# EAGLE design Regulador (EAGLE 9.6.2)
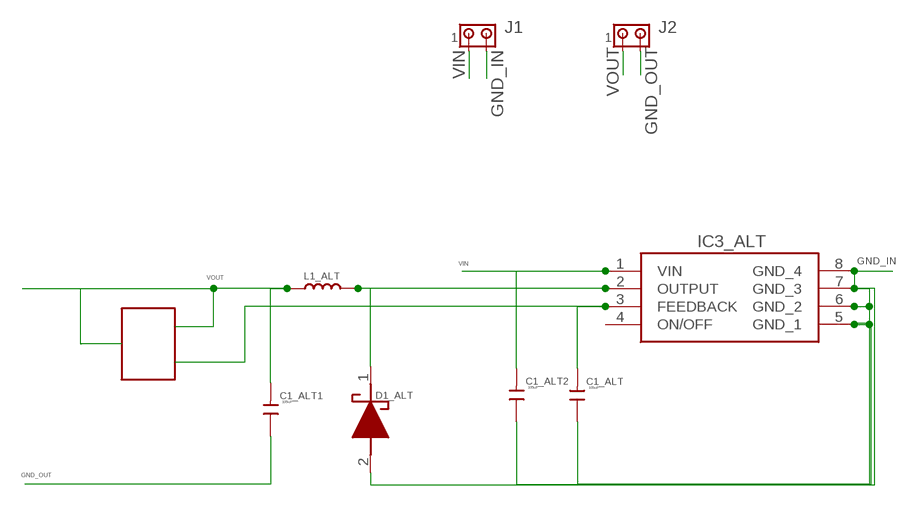
[diagram p0: schematic, sheet 1]

## Parts
C1_ALT  105uF  C-0805  [C0805]
C1_ALT1  105uF  C-0805  [C0805]
C1_ALT2  105uF  C-0805  [C0805]
D1_ALT  1N5819HW1-7-F  [SODFL3518X115N]
IC3_ALT  XL1509-3.3E1  [SOIC127P600X175-8N]
J1  MTA02-156  [1X2MTA]
J2  MTA02-156  [1X2MTA]
L1_ALT  47uH  L'PIO73'  [PIO73]
U$1  TRIMPOT  [TRIMPOT]

## Nets
GND_IN: C1_ALT2.1 C1_ALT.1 D1_ALT.2(A) IC3_ALT.5(GND_1) IC3_ALT.6(GND_2) IC3_ALT.7(GND_3) IC3_ALT.8(GND_4) J1.2
GND_OUT: C1_ALT1.1 J2.2
N$3: D1_ALT.1(K) IC3_ALT.2(OUTPUT) L1_ALT.1
N$8: C1_ALT.2 IC3_ALT.3(FEEDBACK) U$1.OUT
VIN: C1_ALT2.2 IC3_ALT.1(VIN) J1.1
VOUT: C1_ALT1.2 J2.1 L1_ALT.2 U$1.VCC1 U$1.VCC2
Unconnected: IC3_ALT.4(ON/OFF)

## Library data of the parts
C1_ALT C1_ALT1 C1_ALT2 = discrete:C*: Ceramic Capacitors
D1_ALT = 1N5819HW1-7-F:1N5819HW1-7-F: 1N5819 Schottky Diode 40V 1A SOD123F Source: Datasheet <https://www.diodes.com/assets/Datasheets/1N5819HW1.pdf>; ARROW_PART_NUMBER: 1N5819HW1-7-F; ARROW_PRICE-STOCK: https://www.arrow.com/en/products/1n5819hw1-7-f/diodes-incorporated?region=nac; DESCRIPTION: 1N5819 Schottky Diode 40V 1A SOD123F; HEIGHT: 1.15mm; MANUFACTURER_NAME: Diodes Inc.; MANUFACTURER_PART_NUMBER: 1N5819HW1-7-F; MOUSER_PART_NUMBER: 621-1N5819HW1-7-F; MOUSER_PRICE-STOCK: https://www.mouser.co.uk/ProductDetail/Diodes-Incorporated/1N5819HW1-7-F?qs=60RJRzIpcl9ACQG7Zn63jQ%3D%3D
IC3_ALT = XL1509-3.3E1:XL1509-3.3E1: 40V 2A SOP-8_150mil DC-DC Converters RoHS Source: Datasheet <https://datasheet.lcsc.com/szlcsc/XLSEMI-XL1509-3-3E1_C74193.pdf>; DESCRIPTION: 40V 2A SOP-8_150mil DC-DC Converters RoHS; HEIGHT: 1.75mm; MANUFACTURER_NAME: XLSEMI; MANUFACTURER_PART_NUMBER: XL1509-3.3E1
J1 J2 = con-amp:MTA02-156: AMP connector
L1_ALT = discrete:L*
U$1 = TRIMPOT:TRIMPOT

## Board
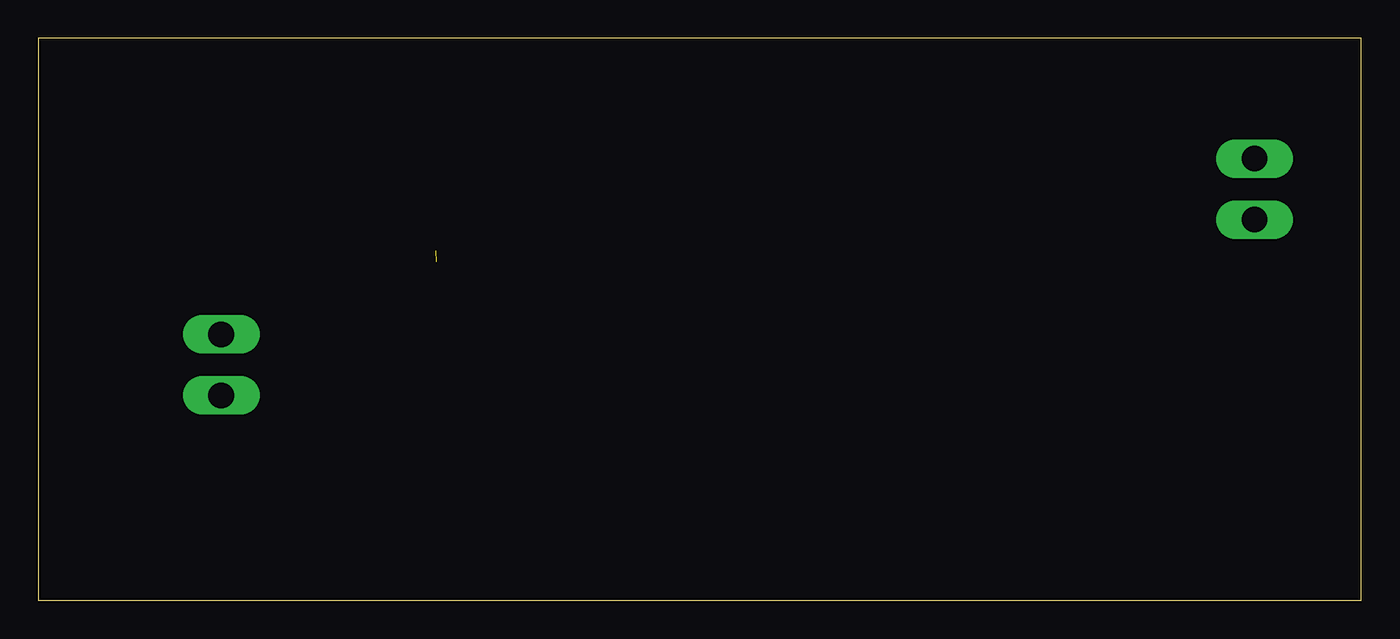
[diagram p1: board, top side]
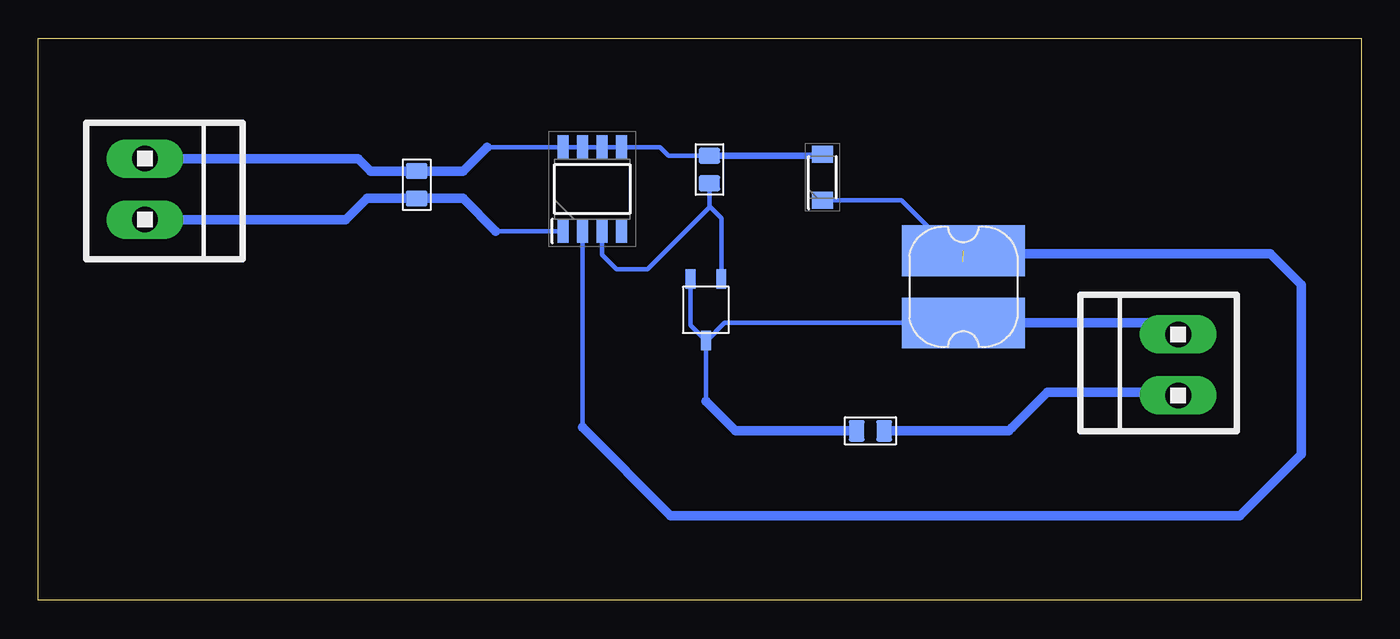
[diagram p2: board, bottom side, seen from below]

Size 86 x 36.52 mm. Coordinates in mm from the lower left corner, seen from the top.
Outline: 0,0 86,0 86,36.52 0,36.52 0,0
Copper layers (1*16): Top 0.035mm / dielectric 1.5mm / Bottom 0.035mm
Design rules "default": minimum track width 6mil, minimum drill 0.35mm, track to track 6mil, track to pad 6mil, pad to pad 6mil, via to via 6mil, smd to smd 6mil, copper to edge 40mil, drill to drill 6mil, minimum pad ring 10mil, minimum via ring 8mil, stop-mask expansion 4mil, vias tented up to drill 0mil, thermal gap 10mil

### Footprints (pad centres in the part's own frame; a part is rotated, then mirrored left to right if it is on the bottom)
C0805 = smd 1.016 x 1.397: 1 -0.889,0; 2 0.889,0
SODFL3518X115N = smd 1.12 x 1.37: 1 -1.5,0; 2 1.5,0
SOIC127P600X175-8N = smd 1.55 x 0.7: 1 -2.725,1.905; 2 -2.725,0.635; 3 -2.725,-0.635; 4 -2.725,-1.905; 5 2.725,-1.905; 6 2.725,-0.635; 7 2.725,0.635; 8 2.725,1.905
1X2MTA = drill 1.676 long: 1 1.981,0; 2 -1.981,0
PIO73 = smd 8 x 3.3: 1 0,2.35; 2 0,-2.35
TRIMPOT = smd 1.27 x 0.635: OUT 0.5,0.5; VCC1 -3.5,1.5; VCC2 0.5,2.5

### Placement (x,y rotation side)
C1_ALT  42.37,28 270 bottom
C1_ALT1  31.9,11.01 180 bottom
C1_ALT2  61.4,27.01 270 bottom
D1_ALT  35.02,27.5 90 bottom
IC3_ALT  49.99,26.73 90 bottom
J1  79.08,26.73 270 bottom
J2  11.89,15.3 90 bottom
L1_ALT  25.86,20.38 0 bottom
U$1  41.1,20.38 90 bottom

### Tracks (layer width: path | path; a pad name or v marks a point on that pad's centre or on a via)
GND_IN
  Bottom 0.152: 35.13,28.89 D1_ALT.2
  Bottom 0.305: C1_ALT.1 45.02,28.89 45.59,29.46 IC3_ALT.5 IC3_ALT.6 IC3_ALT.7 IC3_ALT.8 56.84,29.46
  Bottom 0.406: C1_ALT.1 35.13,28.89
  Bottom 0.61: J1.2 65.21,28.71 64.4,27.9 C1_ALT2.1 58.4,27.9 56.84,29.46
GND_OUT
  Bottom 0.152: 12.08,13.51 J2.2 | 22.9,11.01 22.69,11.22
  Bottom 0.61: 22.69,11.22 20.4,13.51 12.08,13.51 | C1_ALT1.1 22.9,11.01
N$3  (1 unrouted)
  Bottom 0.152: 26.4,22.51 25.9,22.01
  Bottom 0.305: D1_ALT.1 29.89,26 26.4,22.51 | IC3_ALT.2 50.62,11.23
  Bottom 0.61: 26.4,22.51 5.9,22.51 3.9,20.51 3.9,9.51 7.9,5.51 44.9,5.51 50.62,11.23
N$8
  Bottom 0.152: 42.37,25.61 C1_ALT.2
  Bottom 0.305: U$1.OUT 41.6,24.84 42.37,25.61 | IC3_ALT.3 49.35,22.46 48.4,21.51 46.4,21.51 42.37,25.54 C1_ALT.2
VIN
  Bottom 0.305: 56.28,24 IC3_ALT.1
  Bottom 0.61: 56.28,24 58.4,26.12 C1_ALT2.2 64.64,26.12 66.01,24.75 J1.1
VOUT
  Bottom 0.152: 42.81,17.09 U$1.VCC1 42.56,16.84
  Bottom 0.305: 42.6,12.93 U$1.VCC1 | 42.81,17.09 43.6,17.88 U$1.VCC2 | L1_ALT.2 41.38,18.03 42.56,16.84
  Bottom 0.61: L1_ALT.2 12.64,18.03 J2.1 | C1_ALT1.2 40.68,11.01 42.6,12.93